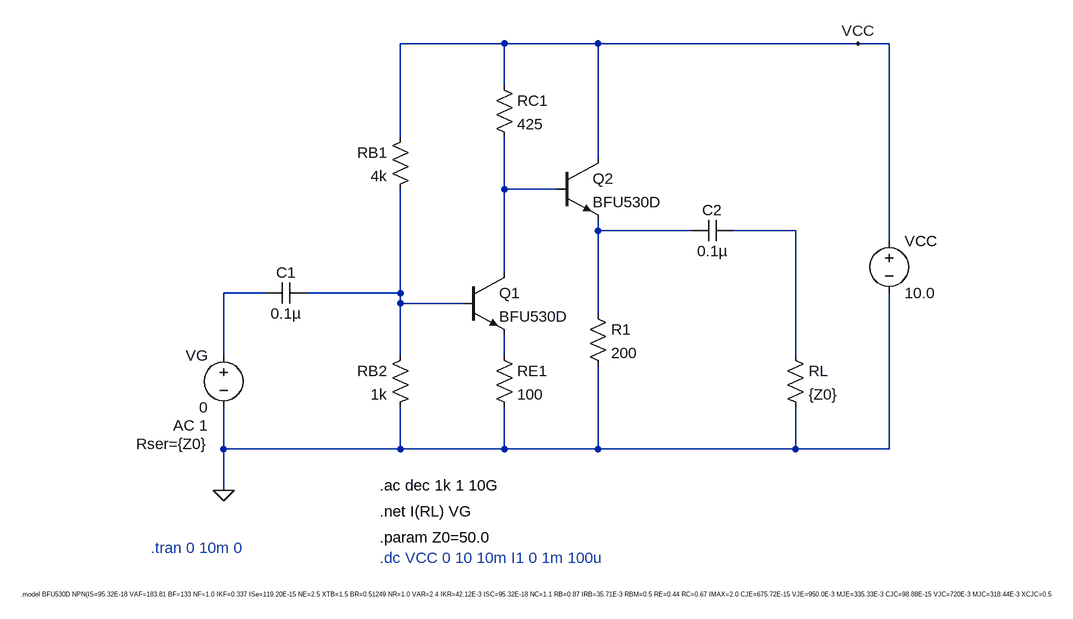
[diagram p0: schematic RF_Gain_Block_Test_Bench.asc]
RF_Gain_Block_Test_Bench.asc, the LTspice schematic file:
Version 4.1
SHEET 1 5052 1700
WIRE 608 0 448 0
WIRE 752 0 608 0
WIRE 1152 0 752 0
WIRE 1200 0 1152 0
WIRE 608 64 608 0
WIRE 448 144 448 0
WIRE 752 176 752 0
WIRE 608 224 608 144
WIRE 688 224 608 224
WIRE 752 288 752 272
WIRE 896 288 752 288
WIRE 1056 288 960 288
WIRE 1200 304 1200 0
WIRE 608 352 608 224
WIRE 240 384 176 384
WIRE 448 384 448 224
WIRE 448 384 304 384
WIRE 448 400 448 384
WIRE 544 400 448 400
WIRE 752 416 752 288
WIRE 176 480 176 384
WIRE 448 480 448 400
WIRE 608 480 608 448
WIRE 1056 480 1056 288
WIRE 176 624 176 560
WIRE 448 624 448 560
WIRE 448 624 176 624
WIRE 608 624 608 560
WIRE 608 624 448 624
WIRE 752 624 752 496
WIRE 752 624 608 624
WIRE 1056 624 1056 560
WIRE 1056 624 752 624
WIRE 1200 624 1200 384
WIRE 1200 624 1056 624
WIRE 176 688 176 624
FLAG 176 688 0
FLAG 1152 0 VCC
SYMBOL voltage 1200 288 R0
WINDOW 123 0 0 Left 0
WINDOW 39 0 0 Left 0
SYMATTR InstName VCC
SYMATTR Value 10.0
SYMBOL npn 544 352 R0
SYMATTR InstName Q1
SYMATTR Value BFU530D
SYMBOL res 592 464 R0
SYMATTR InstName RE1
SYMATTR Value 100
SYMBOL res 592 48 R0
SYMATTR InstName RC1
SYMATTR Value 425
SYMBOL voltage 176 464 M0
WINDOW 123 24 124 Left 2
WINDOW 39 24 152 Left 2
SYMATTR Value2 AC 1
SYMATTR SpiceLine Rser={Z0}
SYMATTR InstName VG
SYMATTR Value 0
SYMBOL cap 240 400 R270
WINDOW 0 32 32 VTop 2
WINDOW 3 0 32 VBottom 2
SYMATTR InstName C1
SYMATTR Value 0.1µ
SYMBOL cap 960 304 M270
WINDOW 0 32 32 VTop 2
WINDOW 3 0 32 VBottom 2
SYMATTR InstName C2
SYMATTR Value 0.1µ
SYMBOL res 1040 464 R0
SYMATTR InstName RL
SYMATTR Value {Z0}
SYMBOL res 464 128 M0
SYMATTR InstName RB1
SYMATTR Value 4k
SYMBOL res 464 464 M0
SYMATTR InstName RB2
SYMATTR Value 1k
SYMBOL npn 688 176 R0
SYMATTR InstName Q2
SYMATTR Value BFU530D
SYMBOL res 736 400 R0
SYMATTR InstName R1
SYMATTR Value 200
TEXT 416 792 Left 2 ;.dc VCC 0 10 10m I1 0 1m 100u
TEXT -136 848 Left 0 !.model BFU530D NPN(IS=95.32E-18 VAF=183.81 BF=133 NF=1.0 IKF=0.337 ISe=119.20E-15 NE=2.5 XTB=1.5 BR=0.51249 NR=1.0 VAR=2.4 IKR=42.12E-3 ISC=95.32E-18 NC=1.1 RB=0.87 IRB=35.71E-3 RBM=0.5 RE=0.44 RC=0.67 IMAX=2.0 CJE=675.72E-15 VJE=950.0E-3 MJE=335.33E-3 CJC=98.88E-15 VJC=720E-3 MJC=318.44E-3 XCJC=0.5 FC=850.0E-3 TF=10.04E-12 XTF=10.0 VTF=1.0 ITF=56.74E-3 PTF=0.0 TR=0.0 KF=109.67E-12 AF=2.0)
TEXT 416 760 Left 2 !.param Z0=50.0
TEXT 416 720 Left 2 !.net I(RL) VG
TEXT 416 680 Left 2 !.ac dec 1k 1 10G
TEXT 64 776 Left 2 ;.tran 0 10m 0

The netlist it stands for:
* RF_Gain_Block_Test_Bench.asc
VCC VCC 0 10.0
Q1 N001 N005 N006 0 BFU530D
RE1 N006 0 100
RC1 VCC N001 425
VG N004 0 0 AC 1 Rser={Z0}
C1 N004 N005 0.1µ
C2 N003 N002 0.1µ
RL N003 0 {Z0}
RB1 VCC N005 4k
RB2 N005 0 1k
Q2 VCC N001 N002 0 BFU530D
R1 N002 0 200
.model NPN NPN
.model PNP PNP
.lib standard.bjt
* .dc VCC 0 10 10m I1 0 1m 100u
.model BFU530D NPN(IS=95.32E-18 VAF=183.81 BF=133 NF=1.0 IKF=0.337 ISe=119.20E-15 NE=2.5 XTB=1.5 BR=0.51249 NR=1.0 VAR=2.4 IKR=42.12E-3 ISC=95.32E-18 NC=1.1 RB=0.87 IRB=35.71E-3 RBM=0.5 RE=0.44 RC=0.67 IMAX=2.0 CJE=675.72E-15 VJE=950.0E-3 MJE=335.33E-3 CJC=98.88E-15 VJC=720E-3 MJC=318.44E-3 XCJC=0.5 FC=850.0E-3 TF=10.04E-12 XTF=10.0 VTF=1.0 ITF=56.74E-3 PTF=0.0 TR=0.0 KF=109.67E-12 AF=2.0)
.param Z0=50.0
.net I(RL) VG
.ac dec 1k 1 10G
* .tran 0 10m 0
.backanno
.end